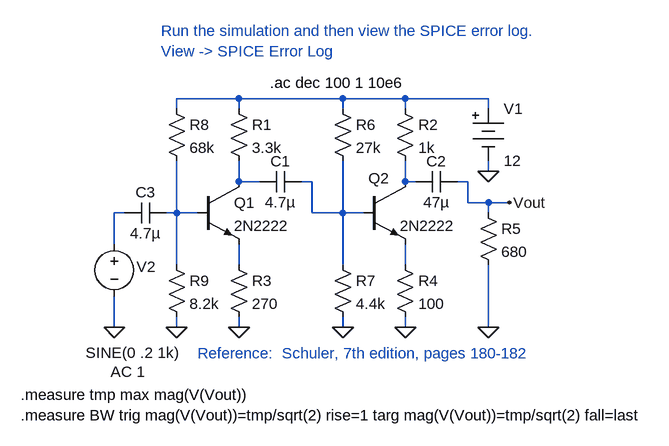
[diagram p0: schematic MeasureBW.asc]
MeasureBW.asc, the LTspice schematic file:
Version 4
SHEET 1 888 680
WIRE -16 64 -112 64
WIRE 144 64 -16 64
WIRE 240 64 144 64
WIRE 368 64 240 64
WIRE -112 80 -112 64
WIRE -16 80 -16 64
WIRE 144 80 144 64
WIRE 240 80 240 64
WIRE 368 80 368 64
WIRE 368 176 368 160
WIRE -16 192 -16 160
WIRE 16 192 -16 192
WIRE 96 192 80 192
WIRE 240 192 240 160
WIRE 256 192 240 192
WIRE 336 192 320 192
WIRE 336 224 336 192
WIRE 368 224 336 224
WIRE 400 224 368 224
WIRE -192 240 -208 240
WIRE -112 240 -112 160
WIRE -112 240 -128 240
WIRE -80 240 -112 240
WIRE 96 240 96 192
WIRE 144 240 144 160
WIRE 144 240 96 240
WIRE 176 240 144 240
WIRE 368 240 368 224
WIRE -208 288 -208 240
WIRE -112 320 -112 240
WIRE -16 320 -16 288
WIRE 144 320 144 240
WIRE 240 320 240 288
WIRE -208 416 -208 368
WIRE -112 416 -112 400
WIRE -16 416 -16 400
WIRE 144 416 144 400
WIRE 240 416 240 400
WIRE 368 416 368 320
FLAG -112 416 0
FLAG -16 416 0
FLAG 144 416 0
FLAG 240 416 0
FLAG 368 416 0
FLAG 368 176 0
FLAG -208 416 0
FLAG 400 224 Vout
SYMBOL npn -80 192 R0
SYMATTR InstName Q1
SYMATTR Value 2N2222
SYMBOL npn 176 192 R0
WINDOW 0 7 -5 Left 0
SYMATTR InstName Q2
SYMATTR Value 2N2222
SYMBOL res -32 64 R0
SYMATTR InstName R1
SYMATTR Value 3.3k
SYMBOL res 224 64 R0
SYMATTR InstName R2
SYMATTR Value 1k
SYMBOL res -32 304 R0
SYMATTR InstName R3
SYMATTR Value 270
SYMBOL res 224 304 R0
SYMATTR InstName R4
SYMATTR Value 100
SYMBOL res 352 224 R0
SYMATTR InstName R5
SYMATTR Value 680
SYMBOL res 128 64 R0
SYMATTR InstName R6
SYMATTR Value 27k
SYMBOL res 128 304 R0
SYMATTR InstName R7
SYMATTR Value 4.4k
SYMBOL res -128 64 R0
SYMATTR InstName R8
SYMATTR Value 68k
SYMBOL res -128 304 R0
SYMATTR InstName R9
SYMATTR Value 8.2k
SYMBOL Misc\\battery 368 64 R0
WINDOW 123 0 0 Left 0
WINDOW 39 0 0 Left 0
SYMATTR InstName V1
SYMATTR Value 12
SYMBOL cap 80 176 R90
WINDOW 0 0 32 VBottom 0
WINDOW 3 32 32 VTop 0
SYMATTR InstName C1
SYMATTR Value 4.7µ
SYMBOL cap 320 176 R90
WINDOW 0 0 32 VBottom 0
WINDOW 3 32 32 VTop 0
SYMATTR InstName C2
SYMATTR Value 47µ
SYMBOL cap -128 224 R90
WINDOW 0 0 32 VBottom 0
WINDOW 3 32 32 VTop 0
SYMATTR InstName C3
SYMATTR Value 4.7µ
SYMBOL voltage -208 272 R0
WINDOW 0 34 51 Left 0
WINDOW 3 -44 183 Left 0
WINDOW 123 -6 212 Left 0
WINDOW 39 0 0 Left 0
SYMATTR InstName V2
SYMATTR Value SINE(0 .2 1k)
SYMATTR Value2 AC 1
TEXT 32 40 Left 0 !.ac dec 100 1 10e6
TEXT -80 456 Left 0 ;Reference:  Schuler, 7th edition, pages 180-182
TEXT -352 520 Left 0 !.measure tmp max mag(V(Vout))\n.measure BW trig mag(V(Vout))=tmp/sqrt(2) rise=1 targ mag(V(Vout))=tmp/sqrt(2) fall=last
TEXT -136 -40 Left 0 ;Run the simulation and then view the SPICE error log.\nView -> SPICE Error Log

The netlist it stands for:
* MeasureBW.asc
Q1 N002 N006 N007 0 2N2222
Q2 N004 N003 N008 0 2N2222
R1 N001 N002 3.3k
R2 N001 N004 1k
R3 N007 0 270
R4 N008 0 100
R5 Vout 0 680
R6 N001 N003 27k
R7 N003 0 4.4k
R8 N001 N006 68k
R9 N006 0 8.2k
V1 N001 0 12
C1 N003 N002 4.7µ
C2 Vout N004 47µ
C3 N006 N005 4.7µ
V2 N005 0 SINE(0 .2 1k) AC 1
.model NPN NPN
.model PNP PNP
.lib standard.bjt
.ac dec 100 1 10e6
* Reference:  Schuler, 7th edition, pages 180-182
.measure tmp max mag(V(Vout))
.measure BW trig mag(V(Vout))=tmp/sqrt(2) rise=1 targ mag(V(Vout))=tmp/sqrt(2) fall=last
* Run the simulation and then view the SPICE error log.
* View -> SPICE Error Log
.backanno
.end